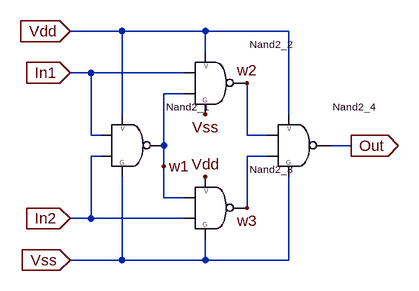
[diagram p0: schematic XOR2.asc]
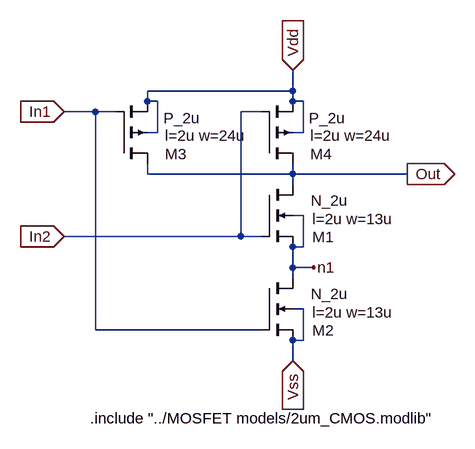
[diagram p1: sub-circuit nand2.asc]
XOR2.asc, the LTspice schematic file:
Version 4
SHEET 1 880 680
WIRE -48 -80 -128 -80
WIRE 80 -80 -48 -80
WIRE 208 -80 80 -80
WIRE 80 -48 80 -80
WIRE -96 -16 -128 -16
WIRE 48 -16 -96 -16
WIRE 48 16 16 16
WIRE -48 48 -48 -80
WIRE 208 48 208 -80
WIRE -96 80 -96 -16
WIRE -80 80 -96 80
WIRE 144 80 144 0
WIRE 176 80 144 80
WIRE 16 96 16 16
WIRE 304 96 272 96
WIRE -80 112 -96 112
WIRE 176 112 144 112
WIRE 16 128 16 96
WIRE 16 176 16 128
WIRE 48 176 16 176
WIRE 144 192 144 112
WIRE -96 208 -96 112
WIRE -96 208 -128 208
WIRE 48 208 -96 208
WIRE -48 272 -48 144
WIRE -48 272 -128 272
WIRE 80 272 80 240
WIRE 80 272 -48 272
WIRE 208 272 208 144
WIRE 208 272 80 272
FLAG -128 -80 Vdd
IOPIN -128 -80 In
FLAG -128 272 Vss
IOPIN -128 272 In
FLAG -128 -16 In1
IOPIN -128 -16 In
FLAG -128 208 In2
IOPIN -128 208 In
FLAG 304 96 Out
IOPIN 304 96 Out
FLAG 80 144 Vdd
FLAG 80 48 Vss
FLAG 16 128 w1
FLAG 144 0 w2
FLAG 144 192 w3
SYMBOL NAND2 -64 96 R0
SYMATTR InstName Nand2_1
SYMBOL NAND2 64 0 R0
SYMATTR InstName Nand2_2
SYMBOL NAND2 64 192 R0
SYMATTR InstName Nand2_3
SYMBOL NAND2 192 96 R0
SYMATTR InstName Nand2_4

nand2.asc, the sub-circuit schematic file:
Version 4
SHEET 1 880 680
WIRE 192 48 192 16
WIRE 192 48 -32 48
WIRE -32 64 -32 48
WIRE -16 64 -32 64
WIRE 192 64 192 48
WIRE 208 64 192 64
WIRE -112 80 -160 80
WIRE -80 80 -112 80
WIRE 144 80 112 80
WIRE -16 112 -16 64
WIRE -16 112 -32 112
WIRE 208 112 208 64
WIRE 208 112 192 112
WIRE -32 176 -32 160
WIRE 192 176 192 160
WIRE 192 176 -32 176
WIRE 368 176 192 176
WIRE 192 192 192 176
WIRE 208 240 192 240
WIRE 112 272 112 80
WIRE 112 272 -160 272
WIRE 144 272 112 272
WIRE 208 288 208 240
WIRE 208 288 192 288
WIRE 192 320 192 288
WIRE 224 320 192 320
WIRE 192 336 192 320
WIRE 208 384 192 384
WIRE -112 416 -112 80
WIRE 144 416 -112 416
WIRE 208 432 208 384
WIRE 208 432 192 432
WIRE 192 464 192 432
FLAG 192 16 Vdd
IOPIN 192 16 In
FLAG 192 464 Vss
IOPIN 192 464 In
FLAG -160 80 In1
IOPIN -160 80 In
FLAG -160 272 In2
IOPIN -160 272 In
FLAG 368 176 Out
IOPIN 368 176 Out
FLAG 224 320 n1
SYMBOL nmos4 144 192 R0
WINDOW 0 78 81 Left 2
WINDOW 3 76 25 Left 2
WINDOW 123 78 53 Left 2
SYMATTR InstName M1
SYMATTR Value N_2u
SYMATTR Value2 l=2u w=13u
SYMBOL pmos4 144 160 M180
WINDOW 0 75 15 Left 2
WINDOW 3 73 70 Left 2
WINDOW 123 75 43 Left 2
SYMATTR InstName M4
SYMATTR Value P_2u
SYMATTR Value2 l=2u w=24u
SYMBOL pmos4 -80 160 M180
WINDOW 0 75 15 Left 2
WINDOW 3 73 70 Left 2
WINDOW 123 75 43 Left 2
SYMATTR InstName M3
SYMATTR Value P_2u
SYMATTR Value2 l=2u w=24u
SYMBOL nmos4 144 336 R0
WINDOW 0 78 81 Left 2
WINDOW 3 76 25 Left 2
WINDOW 123 78 53 Left 2
SYMATTR InstName M2
SYMATTR Value N_2u
SYMATTR Value2 l=2u w=13u
TEXT -120 552 Left 2 !.include "../MOSFET models/2um_CMOS.modlib"

The netlist it stands for:
* XOR2.asc
XNand2_1 In1 In2 w1 Vdd Vss nand2
XNand2_2 In1 w1 w2 Vdd Vss nand2
XNand2_3 w1 In2 w3 Vdd Vss nand2
XNand2_4 w2 w3 Out Vdd Vss nand2

* block symbol definitions
.subckt nand2 In1 In2 Out Vdd Vss
M1 Out In2 n1 n1 N_2u l=2u w=13u
M4 Out In2 Vdd Vdd P_2u l=2u w=24u
M3 Out In1 Vdd Vdd P_2u l=2u w=24u
M2 n1 In1 Vss Vss N_2u l=2u w=13u
.include "../MOSFET models/2um_CMOS.modlib"
.ends nand2

.model NMOS NMOS
.model PMOS PMOS
.lib standard.mos
.backanno
.end